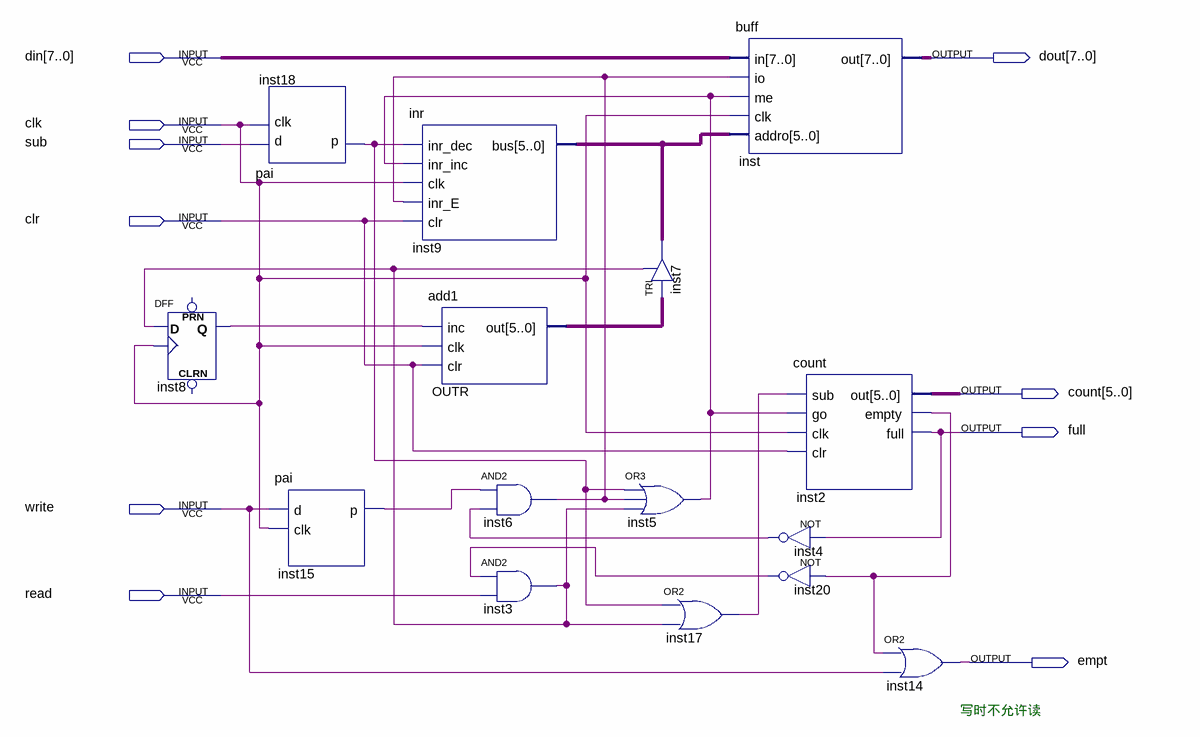
[diagram p0: schematic sheet]
// Quartus schematic inputa2.bdf as structural Verilog: 15 symbols, 10 pins
module inputa2 (
  input  [7:0] din,
  input  clk,
  input  sub,
  input  clr,
  input  write,
  input  read,
  output [7:0] dout,
  output [5:0] count,
  output full,
  output empt
);

  wire inst2_empty, inst3_out, inst4_out, inst5_out, inst6_out, inst8_q, inst15_p, inst17_out, inst18_p,
       inst20_out;
  wire [5:0] inst9_bus, OUTR_out;

  DFF inst8 (.CLK(clk), .D(inst3_out), .Q(inst8_q));  // open: CLRN, PRN
  pai inst18 (.d(sub), .clk(clk), .p(inst18_p));
  pai inst15 (.d(write), .clk(clk), .p(inst15_p));
  inr inst9 (.inr_dec(inst18_p), .inr_inc(inst5_out), .clk(clk), .inr_E(inst6_out), .clr(clr), .bus(inst9_bus));
  add1 OUTR (.inc(inst8_q), .clk(clk), .clr(clr), .out(OUTR_out));
  and inst6 (inst6_out, inst15_p, inst4_out);
  and inst3 (inst3_out, inst20_out, read);
  TRI inst7[5:0] (.IN(OUTR_out), .OE(inst3_out), .OUT(inst9_bus));
  or inst5 (inst5_out, inst18_p, inst6_out, inst3_out);
  buff inst (.in(din), .io(inst6_out), .me(inst5_out), .clk(clk), .addro(inst9_bus), .out(dout));
  or inst17 (inst17_out, inst18_p, inst3_out);
  count inst2 (.sub(inst17_out), .go(inst5_out), .clk(clk), .clr(clr), .out(count), .empty(inst2_empty), .full(full));
  not inst4 (inst4_out, full);
  not inst20 (inst20_out, inst2_empty);
  or inst14 (empt, inst2_empty, write);

  // Notes on the sheet:
  //   写时不允许读
endmodule
